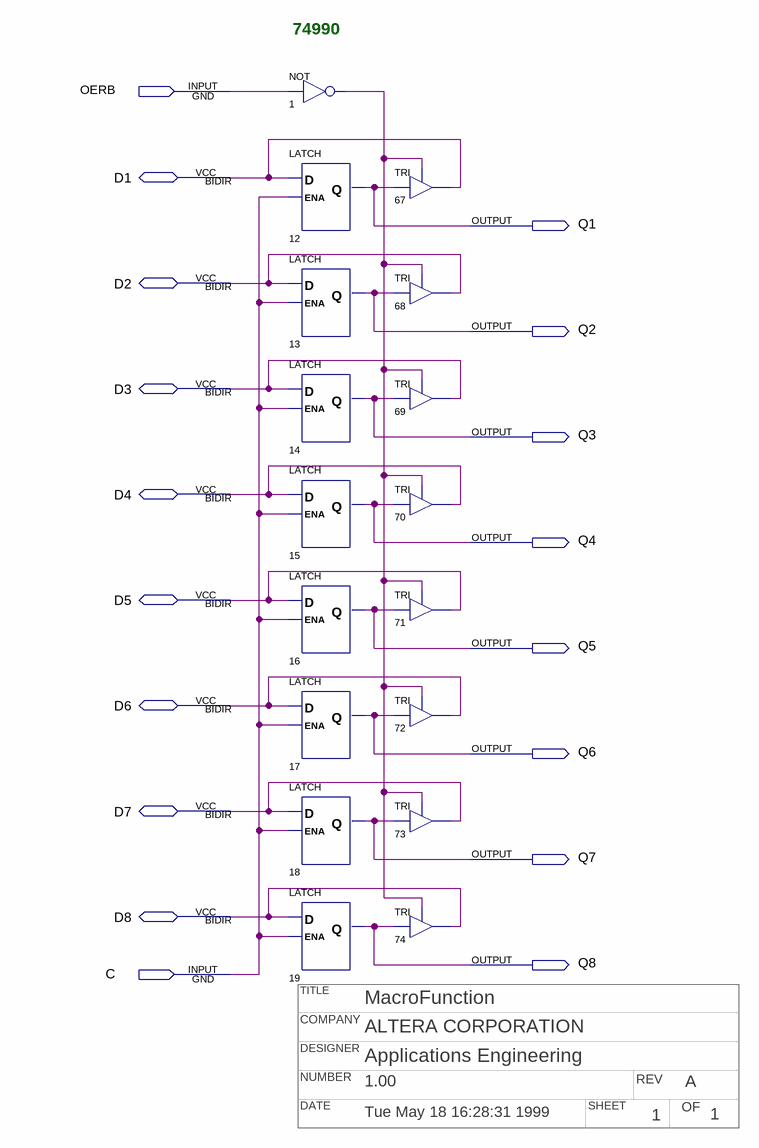
[diagram p0: schematic sheet]
// Quartus schematic 74990.bdf as structural Verilog: 17 symbols, 18 pins
// Title block: TITLE: MacroFunction; COMPANY: ALTERA CORPORATION; DESIGNER: Applications Engineering; NUMBER: 1.00; REV: A; DATE: Tue May 18 16:28:31 1999; SHEET: 1; OF: 1
module \74990  (
  input  OERB,
  input  C,
  inout  D1,
  inout  D2,
  inout  D3,
  inout  D4,
  inout  D5,
  inout  D6,
  inout  D7,
  inout  D8,
  output Q1,
  output Q2,
  output Q3,
  output Q4,
  output Q5,
  output Q6,
  output Q7,
  output Q8
);

  wire n1_out;

  not u_1 (n1_out, OERB);
  LATCH u_12 (.D(D1), .ENA(C), .Q(Q1));
  LATCH u_13 (.D(D2), .ENA(C), .Q(Q2));
  LATCH u_14 (.D(D3), .ENA(C), .Q(Q3));
  LATCH u_15 (.D(D4), .ENA(C), .Q(Q4));
  LATCH u_16 (.D(D5), .ENA(C), .Q(Q5));
  LATCH u_17 (.D(D6), .ENA(C), .Q(Q6));
  LATCH u_18 (.D(D7), .ENA(C), .Q(Q7));
  LATCH u_19 (.D(D8), .ENA(C), .Q(Q8));
  TRI u_67 (.IN(Q1), .OE(n1_out), .OUT(D1));
  TRI u_68 (.IN(Q2), .OE(n1_out), .OUT(D2));
  TRI u_69 (.IN(Q3), .OE(n1_out), .OUT(D3));
  TRI u_70 (.IN(Q4), .OE(n1_out), .OUT(D4));
  TRI u_71 (.IN(Q5), .OE(n1_out), .OUT(D5));
  TRI u_72 (.IN(Q6), .OE(n1_out), .OUT(D6));
  TRI u_73 (.IN(Q7), .OE(n1_out), .OUT(D7));
  TRI u_74 (.IN(Q8), .OE(n1_out), .OUT(D8));

  // Notes on the sheet:
  //   74990
endmodule
